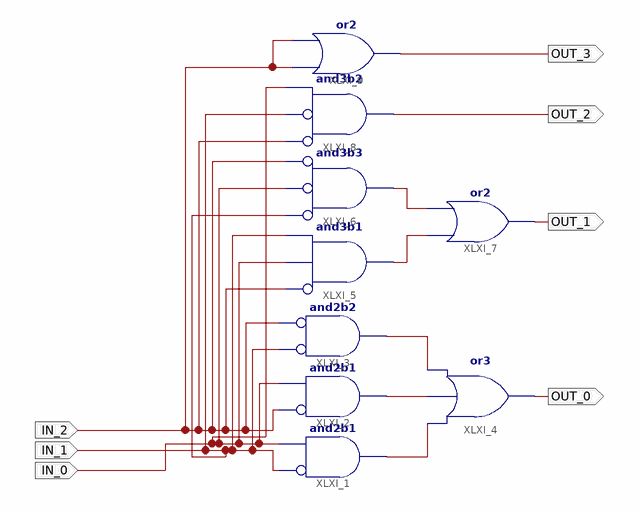
[diagram p0: schematic sheet 1]
// Xilinx ISE schematic My3To4Decoder.sch (spartan3a) as structural Verilog: 9 symbols, 7 ports
module My3To4Decoder (
  input  IN_0,
  input  IN_1,
  input  IN_2,
  output OUT_0,
  output OUT_1,
  output OUT_2,
  output OUT_3
);

  wire XLXN_2, XLXN_3, XLXN_4, XLXN_14, XLXN_15;

  and XLXI_1 (XLXN_4, ~IN_1, IN_0);  // and2b1
  and XLXI_2 (XLXN_3, ~IN_2, IN_0);  // and2b1
  and XLXI_3 (XLXN_2, ~IN_1, ~IN_2);  // and2b2
  or XLXI_4 (OUT_0, XLXN_4, XLXN_3, XLXN_2);
  and XLXI_5 (XLXN_15, ~IN_2, IN_0, IN_1);  // and3b1
  and XLXI_6 (XLXN_14, ~IN_1, ~IN_0, ~IN_2);  // and3b3
  or XLXI_7 (OUT_1, XLXN_15, XLXN_14);
  and XLXI_8 (OUT_2, ~IN_2, ~IN_1, IN_0);  // and3b2
  or XLXI_9 (OUT_3, IN_2, IN_2);
endmodule
